# EAGLE design PPM_enconder_v12 (EAGLE 5.09)
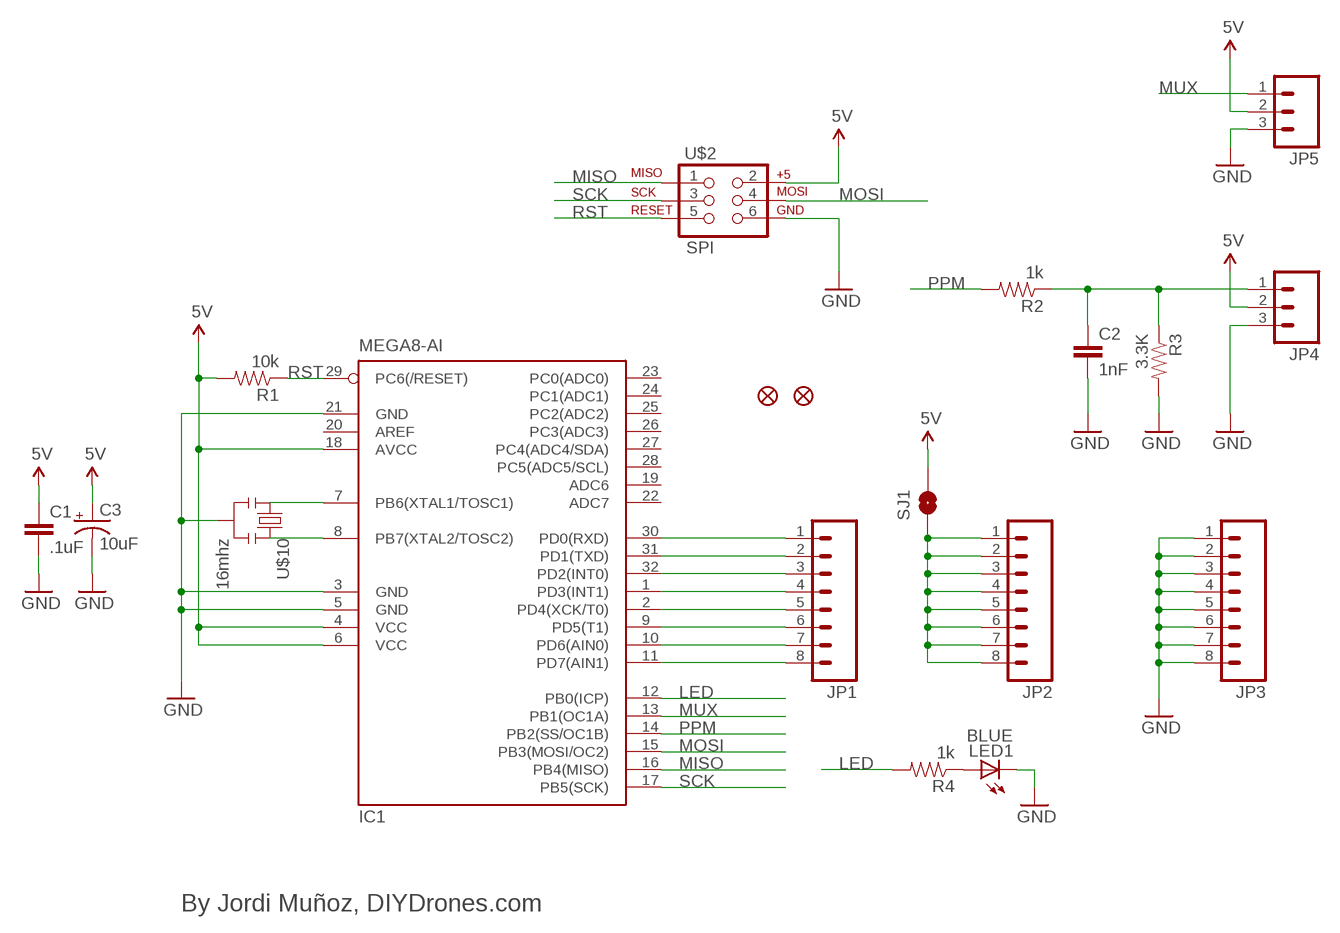
[diagram p0: schematic, sheet 1]

## Parts
C1  .1uF  CAP0402  [C0402]
C2  1nF  CAP0402  [C0402]
C3  10uF  CAP_POL1206  [EIA3216]
IC1  MEGA8-AI  [TQFP32-08]
JP1  M08  [1X08]
JP2  M08  [1X08]
JP3  M08  [1X08]
JP4  M03PTH  [1X03]
JP5  M03PTH  [1X03]
JP6  FIDUCIAL1X2  [FIDUCIAL-1X2]
JP7  FIDUCIAL1X2  [FIDUCIAL-1X2]
LED1  BLUE  LED0603  [LED-0603]
R1  10k  RESISTOR0402  [C0402]
R2  1k  RESISTOR0402  [C0402]
R3  3.3K  RESISTOR0402  [C0402]
R4  1k  RESISTOR0402  [C0402]
SJ1  SOLDERJUMPERNC2  [SJ_2S]
U$2  SPI  AVR_SPI_PRG_6NS  [2X3-NS]
U$10  16mhz  RESONATORSMD  [RESONATOR-SMD]

## Nets
5V: C1.1 C3.A(+) IC1.4(VCC) IC1.6(VCC) IC1.18(AVCC) JP4.2 JP5.2 R1.2 SJ1.2 U$2.2
GND: C1.2 C2.2 C3.C(-) IC1.3(GND) IC1.5(GND) IC1.21(GND) JP3.1 JP3.2 JP3.3 JP3.4 JP3.5 JP3.6 JP3.7 JP3.8 JP4.3 JP5.3 LED1.C R3.2 U$2.6 U$10.2
LED: IC1.12(PB0(ICP)) R4.2
MISO: IC1.16(PB4(MISO)) U$2.1
MOSI: IC1.15(PB3(MOSI/OC2)) U$2.4
MUX: IC1.13(PB1(OC1A)) JP5.1
N$1: IC1.30(PD0(RXD)) JP1.1
N$2: IC1.31(PD1(TXD)) JP1.2
N$3: IC1.32(PD2(INT0)) JP1.3
N$4: IC1.1(PD3(INT1)) JP1.4
N$5: IC1.2(PD4(XCK/T0)) JP1.5
N$6: IC1.9(PD5(T1)) JP1.6
N$7: IC1.10(PD6(AIN0)) JP1.7
N$8: IC1.11(PD7(AIN1)) JP1.8
N$9: C2.1 JP4.1 R2.1 R3.1
N$10: LED1.A R4.1
N$11: JP2.1 JP2.2 JP2.3 JP2.4 JP2.5 JP2.6 JP2.7 JP2.8 SJ1.1
N$12: IC1.7(PB6(XTAL1/TOSC1)) U$10.1
N$13: IC1.8(PB7(XTAL2/TOSC2)) U$10.3
PPM: IC1.14(PB2(SS/OC1B)) R2.2
RST: IC1.29(PC6(/RESET)) R1.1 U$2.5
SCK: IC1.17(PB5(SCK)) U$2.3
Unconnected: IC1.19(ADC6) IC1.20(AREF) IC1.22(ADC7) IC1.23(PC0(ADC0)) IC1.24(PC1(ADC1)) IC1.25(PC2(ADC2)) IC1.26(PC3(ADC3)) IC1.27(PC4(ADC4/SDA)) IC1.28(PC5(ADC5/SCL))

## Notes on the sheet
- By Jordi Muñoz, DIYDrones.com

## Library data of the parts
C1 C2 = DIYdrones3:CAP: Capacitor Standard 0603 ceramic capacitor, and 0.1" leaded capacitor.
C3 = DIYdrones3:CAP_POL: Capacitor Polarized These are standard SMD and PTH capacitors. Normally 10uF, 47uF, and 100uF in electrolytic and tantalum varieties. Always verify the external diameter of the through hole cap, it varies with capacity, voltage, and manufacturer. The EIA devices should be standard.
IC1 = atmel:MEGA8: MICROCONTROLLER 8 Kbytes FLASH, 1 kbytes SRAM, 512 bytes EEPROM, USART, 6-channel 10 bit ADC, 2-channel 8 bit ADC Pin compatible with Atmega48, ATMega88, ATMega168 Source: avr.lbr
JP1-JP3 = DIYdrones3:M08: Header 8 Standard 8-pin 0.1" header. Use with straight break away headers (SKU : PRT-00116), right angle break away headers (PRT-00553), swiss pins (PRT-00743), machine pins (PRT-00117), and female headers (PRT-00115).
JP4 JP5 = DIYdrones3:M03: Header 3 Standard 3-pin 0.1" header. Use with straight break away headers (SKU : PRT-00116), right angle break away headers (PRT-00553), swiss pins (PRT-00743), machine pins (PRT-00117), and female headers (PRT-00115). Molex polarized connector foot print use with SKU : PRT-08232 with associated crimp pins and housings.
JP6 JP7 = SparkFun:FIDUCIAL: Fiducial Alignment Points Various fiducial points for machine vision alignment.
LED1 = DIYdrones3:LED: LEDs Standard schematic elements and footprints for 5mm, 3mm, 1206, and 0603 sized LEDs. 5mm - Spark Fun Electronics SKU : COM-00529 (and others)
R1-R4 = DIYdrones3:RESISTOR: Resistor Basic schematic elements and footprints for 0603, 1206, and PTH 1/10th watt (small) resistors.
SJ1 = DIYdrones3:SOLDERJUMPER: Solder Jumper Standard SMD solder jumper. Used to automate production. Two varients : Normally Open and Normally Closed are the same, but have different paste layers. NC will have a large amount of paste and should jumper during reflow.
U$2 = DIYdrones3:AVR_SPI_PRG_6: AVR ISP 6 Pin This is the reduced ISP connector for AVR programming. Common on Arduino. This footprint will take up less PCB space and can be used with a 10-pin to 6-pin adapter such as SKU: BOB-08508
U$10 = DIYdrones3:RESONATOR: Resonator Small SMD resonator. This is the itty bitty 10/20MHz resonators with built in caps. CSTCE10M0G55 and CSTCE20M0V53. Footprint has been reviewed closely but hasn't been tested yet.

## Board
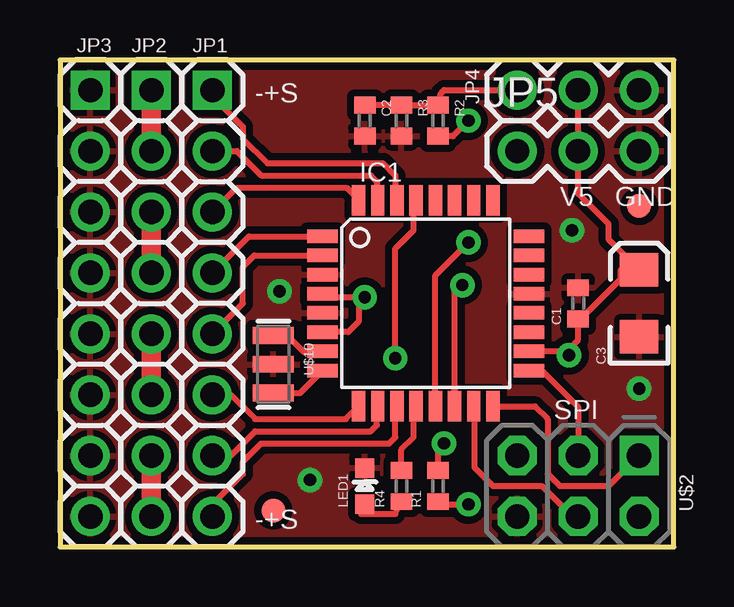
[diagram p1: board, top side]
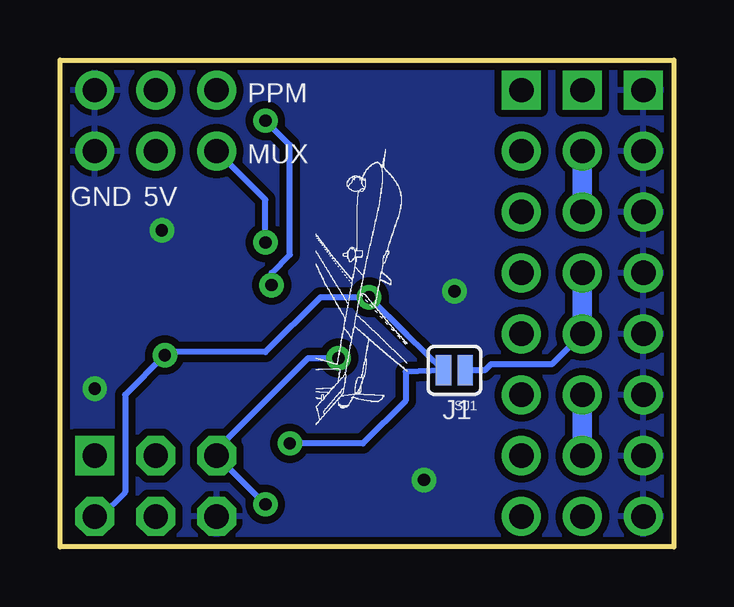
[diagram p2: board, bottom side, seen from below]

Size 25.58 x 20.31 mm. Coordinates in mm from the lower left corner, seen from the top.
Outline: 0,0 25.58,0 25.58,20.31 0,20.31 0,0
Copper layers (1*16): Top 0.035mm / dielectric 1.5mm / Bottom 0.035mm
Design rules "SparkFun": minimum track width 8mil, minimum drill 20mil, track to track 8mil, track to pad 8mil, pad to pad 8mil, via to via 8mil, smd to smd 8mil, copper to edge 10mil, drill to drill 8mil, minimum pad ring 12mil, minimum via ring 10mil, stop-mask expansion 4mil, vias tented up to drill 25mil, thermal gap 10mil

### Footprints (pad centres in the part's own frame; a part is rotated, then mirrored left to right if it is on the bottom)
C0402 = smd 0.7 x 0.9: 1 -0.65,0; 2 0.65,0
EIA3216 = smd 1.4 x 1.6: A 1.4,0; C -1.4,0
TQFP32-08 = smd 1.27 x 0.559: 1 -4.293,2.8; 2 -4.293,2; 3 -4.293,1.2; 4 -4.293,0.4; 5 -4.293,-0.4; 6 -4.293,-1.2; 7 -4.293,-2; 8 -4.293,-2.8; 17 4.293,-2.8; 18 4.293,-2; 19 4.293,-1.2; 20 4.293,-0.4; 21 4.293,0.4; 22 4.293,1.2; 23 4.293,2; 24 4.293,2.8 | smd 0.559 x 1.27: 9 -2.8,-4.293; 10 -2,-4.293; 11 -1.2,-4.293; 12 -0.4,-4.293; 13 0.4,-4.293; 14 1.2,-4.293; 15 2,-4.293; 16 2.8,-4.293; 25 2.8,4.293; 26 2,4.293; 27 1.2,4.293; 28 0.4,4.293; 29 -0.4,4.293; 30 -1.2,4.293; 31 -2,4.293; 32 -2.8,4.293
1X08 = drill 1.016 square: 1 0,0 | drill 1.016 round: 2 2.54,0; 3 5.08,0; 4 7.62,0; 5 10.16,0; 6 12.7,0; 7 15.24,0; 8 17.78,0
1X03 = drill 1.016 round: 1 0,0; 2 2.54,0; 3 5.08,0
FIDUCIAL-1X2 = smd 1 x 1: 1 0,0
LED-0603 = smd 0.8 x 0.8: A 0,-0.75; C 0,0.75
SJ_2S = smd 0.635 x 1.27: 1 -0.45,0; 2 0.45,0
2X3-NS = drill 1.016 square: 1 -2.54,-1.27 | drill 1.016 octagon: 2 -2.54,1.27; 3 0,-1.27; 4 0,1.27; 5 2.54,-1.27; 6 2.54,1.27
RESONATOR-SMD = smd 0.7 x 1.7: 1 -1.2,0; 2 0,0; 3 1.2,0

### Placement (x,y rotation side)
C1  21.59,10.16 90 top
C2  12.7,17.78 270 top
C3  24.13,10.16 90 top
IC1  15.24,10.16 0 top
JP1  6.35,19.05 270 top
JP2  3.81,19.05 270 top
JP3  1.27,19.05 270 top
JP4  19.05,19.05 0 top
JP5  19.05,16.51 0 top
JP6  24.13,14.22 0 top
JP7  8.89,1.52 0 top
LED1  12.7,2.54 0 top
R1  15.75,2.54 90 top
R2  15.75,17.78 270 top
R3  14.22,17.78 270 top
R4  14.22,2.54 90 top
SJ1  9.14,7.37 180 bottom
U$2  21.59,2.54 180 top
U$9  [UAV_LOGO_SMED]  13.21,10.41 270 bottom
U$10  8.89,7.62 270 top

### Tracks (layer width: path | path; a pad name or v marks a point on that pad's centre or on a via)
5V  (via drill 0.51)
  Top 0.254: JP4.2 JP5.2 21.59,14.73 22.86,13.46 22.86,12.83 C3.A 23.37,11.56 23.37,11.18 21.96,9.76 C1.1 21.59,8.64 21.21,8.26 v21.21,8 21.05,8.16 IC1.18 | 11.02,8.89 IC1.6 12.01,8.96 12.45,9.4 12.45,10.16 v12.7,10.41 11.09,10.41 IC1.4 | R1.2 15.75,4.06 v16,4.32
  Bottom 0.254: U$2.2 23.88,1.27 22.86,2.29 22.86,6.35 v21.21,8 21.08,8.13 17.02,8.13 14.73,10.41 v12.7,10.41 11.12,8.83 SJ1.2 11.18,7.31 11.18,6.1 12.95,4.32 v16,4.32
GND  (via drill 0.51)
  other vias: 10.41,2.79 21.34,13.21 24.13,6.6 9.14,10.67
  pour Top (isolate 0.305): 0,20.32 25.65,20.32 25.65,0 0,0
  pour Bottom (isolate 0.305): 0,20.57 25.65,20.57 25.65,0 0,0
LED
  Top 0.254: R4.2 14.22,4.06 14.73,4.57 14.73,5.76 IC1.12
MISO
  Top 0.254: IC1.16 19.79,5.87 20.32,5.33 20.32,3.05 20.83,2.54 22.86,2.54 U$2.1
MOSI
  Top 0.254: U$2.4 21.34,1.27 20.07,2.54 18.03,2.54 17.27,3.3 17.27,5.83 IC1.15
MUX  (via drill 0.51)
  Top 0.254: IC1.13 15.64,11.32 v17.02,12.7
  Bottom 0.254: v17.02,12.7 17.02,14.48 JP5.1
N$1
  Top 0.254: JP1.1 6.35,18.8 7.62,17.53 7.62,17.02 8.64,16 13.46,16 13.97,15.49 13.97,14.52 IC1.30
N$2
  Top 0.254: JP1.2 7.37,16.51 8.38,15.49 12.95,15.49 13.21,15.24 13.21,14.48 IC1.31
N$3
  Top 0.254: IC1.32 12.44,14.48 11.94,14.99 7.37,14.99 JP1.3
N$4
  Top 0.254: JP1.4 7.87,12.95 IC1.1
N$5
  Top 0.254: IC1.2 8.1,12.16 7.62,11.68 7.62,10.16 JP1.5
N$6
  Top 0.254: JP1.6 7.11,6.35 8.13,5.33 11.91,5.33 IC1.9
N$7
  Top 0.254: JP1.7 7.11,3.81 8.13,4.83 12.95,4.83 13.21,5.08 13.21,5.83 IC1.10
N$8
  Top 0.254: JP1.8 6.35,1.78 7.62,3.05 7.62,3.56 8.38,4.32 13.72,4.32 13.97,4.57 13.97,5.8 IC1.11
N$9
  Top 0.254: C2.1 R3.1 R2.1 15.89,18.94 16,19.05 JP4.1
N$10
  Top 0.254: LED1.A 12.55,1.38 13.97,1.38 R4.1
N$11
  Top 0.813: JP2.2 JP2.1 | JP2.6 JP2.5 | JP2.8 JP2.7 | JP2.4 JP2.3
  Bottom 0.254: JP2.5 5.08,7.62 7.62,7.62 7.87,7.37 SJ1.1
  Bottom 0.813: JP2.7 JP2.6 | JP2.5 JP2.4 | JP2.3 JP2.2
N$12
  Top 0.254: IC1.7 10.91,8.13 10.16,8.13 9.4,8.89 8.96,8.89 U$10.1
N$13
  Top 0.254: U$10.3 10.01,6.42 IC1.8
PPM  (via drill 0.51)
  Top 0.254: IC1.14 16.44,10.6 v16.76,10.92 | R2.2 16.37,17.13 v17.02,17.78
  Bottom 0.254: v17.02,17.78 16,16.76 16,12.19 16.76,11.43 v16.76,10.92
RST  (via drill 0.51)
  Top 0.254: v13.97,7.87 13.97,12.45 14.73,13.21 14.73,14.31 IC1.29 | v17.02,1.78 15.86,1.78 R1.1
  Bottom 0.254: v17.02,1.78 U$2.5 19.05,4.06 15.24,7.87 v13.97,7.87
SCK
  Top 0.254: IC1.17 20.07,7.36 21.59,5.84 U$2.3

### Text on the board
tPlace: -+S | V5 | GND | SPI | -+S
bPlace: PPM | MUX | 5V | GND | J1
Document: By Jordi Muñoz, DIYDrones.com